# Altium schematic sheet FPGA_FLASH_EEPROM.SchDoc
size 420 x 297 mm; SheetNumber: 30; SheetTotal: 34
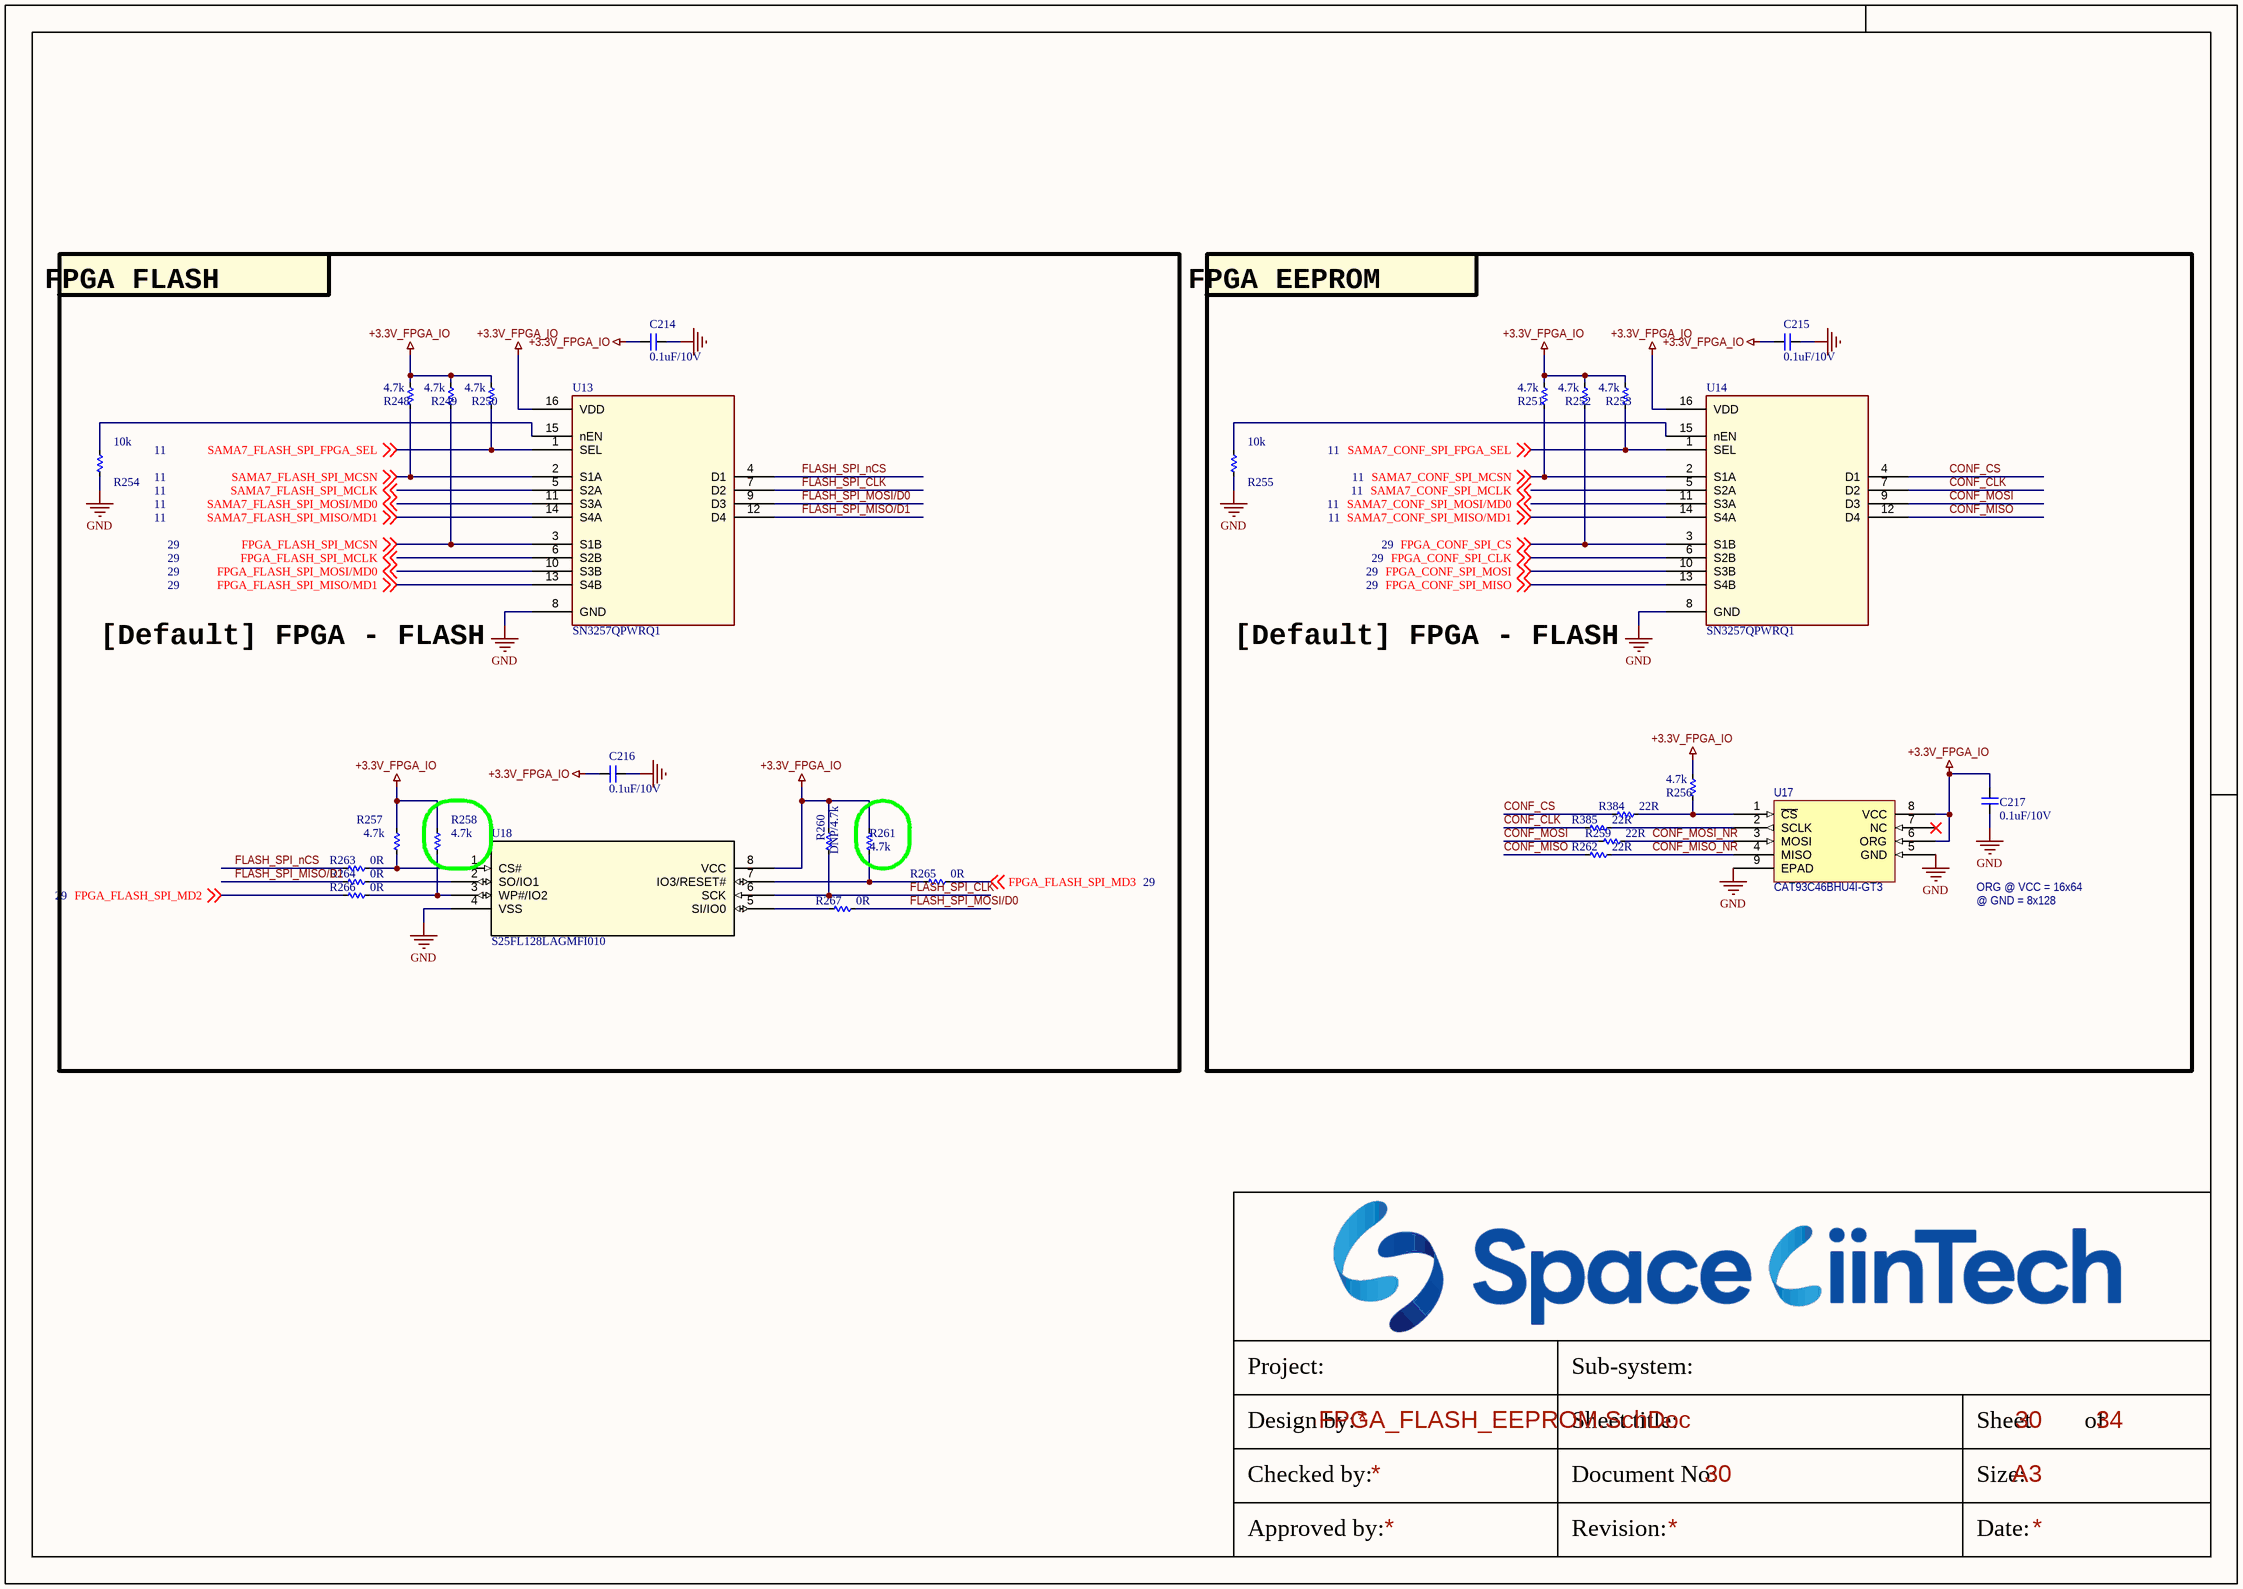
[diagram p0: FPGA_FLASH_EEPROM.SchDoc]

## Parts
C214  0.1uF/10V  [CAP_C_1005X50_L]
C215  0.1uF/10V  [CAP_C_1005X50_L]
C216  0.1uF/10V  [CAP_C_1005X50_L]
C217  0.1uF/10V  [CAP_C_1005X50_L]
R248  4.7k  [RES_C_1005x30_L]
R249  4.7k  [RES_C_1005x30_L]
R250  4.7k  [RES_C_1005x30_L]
R251  4.7k  [RES_C_1005x30_L]
R252  4.7k  [RES_C_1005x30_L]
R253  4.7k  [RES_C_1005x30_L]
R254  10k  [RES_C_1005x30_L]
R255  10k  [RES_C_1005x30_L]
R256  4.7k  [RES_C_1005x30_L]
R257  4.7k  [RES_C_1005x30_L]
R258  4.7k  [RES_C_1005x30_L]
R259  22R  [RES_C_1005x30_L]
R260  DNP/4.7k  [RES_C_1005x30_L]
R261  4.7k  [RES_C_1005x30_L]
R262  22R  [RES_C_1005x30_L]
R263  0R  [RES_C_1005x30_L]
R264  0R  [RES_C_1005x30_L]
R265  0R  [RES_C_1005x30_L]
R266  0R  [RES_C_1005x30_L]
R267  0R  [RES_C_1005x30_L]
R384  22R  [RES_C_1005x30_L]
R385  22R  [RES_C_1005x30_L]
U13  SN3257QPWRQ1  [SOIC_PRQ1_TEX]
U14  SN3257QPWRQ1  [SOIC_PRQ1_TEX]
U17  CAT93C46BHU4I-GT3  [CAT93C46BHU4I-GT3]
U18  S25FL128LAGMFI010  [SOIC8_S25FL_CYP]

## Nets
+3.3V_FPGA_IO: C214.2 C215.2 C216.2 C217.1 R248.2 R249.2 R250.2 R251.2 R252.2 R253.2 R256.2 R257.2 R258.2 R260.2 R261.2 U13.16(VDD) U14.16(VDD) U17.6(ORG) U17.8(VCC) U18.8(VCC)
GND: C214.1 C215.1 C216.1 C217.2 R254.1 R255.1 U13.8(GND) U14.8(GND) U17.5(GND) U17.9(EPAD) U18.4(VSS)
CONF_CLK: R385.2 U14.7(D2)
CONF_CS: R384.2 U14.4(D1)
CONF_MISO: R262.2 U14.12(D4)
CONF_MISO_NR: R262.1 U17.4(MISO)
CONF_MOSI: R259.2 U14.9(D3)
CONF_MOSI_NR: R259.1 U17.3(MOSI)
FLASH_SPI_CLK: R260.1 U13.7(D2) U18.6(SCK)
FLASH_SPI_MISO/D1: R264.1 U13.12(D4)
FLASH_SPI_MOSI/D0: R267.2 U13.9(D3)
FLASH_SPI_nCS: R263.1 U13.4(D1)
FPGA_CONF_SPI_CLK: U14.6(S2B) ; off-sheet FPGA_CONF_SPI_CLK
FPGA_CONF_SPI_CS: R252.1 U14.3(S1B) ; off-sheet FPGA_CONF_SPI_CS
FPGA_CONF_SPI_MISO: U14.13(S4B) ; off-sheet FPGA_CONF_SPI_MISO
FPGA_CONF_SPI_MOSI: U14.10(S3B) ; off-sheet FPGA_CONF_SPI_MOSI
FPGA_FLASH_SPI_MCLK: U13.6(S2B) ; off-sheet FPGA_FLASH_SPI_MCLK
FPGA_FLASH_SPI_MCSN: R249.1 U13.3(S1B) ; off-sheet FPGA_FLASH_SPI_MCSN
FPGA_FLASH_SPI_MD2: R266.1 ; off-sheet FPGA_FLASH_SPI_MD2
FPGA_FLASH_SPI_MD3: R265.2 ; off-sheet FPGA_FLASH_SPI_MD3
FPGA_FLASH_SPI_MISO/MD1: U13.13(S4B) ; off-sheet FPGA_FLASH_SPI_MISO/MD1
FPGA_FLASH_SPI_MOSI/MD0: U13.10(S3B) ; off-sheet FPGA_FLASH_SPI_MOSI/MD0
SAMA7_CONF_SPI_FPGA_SEL: R253.1 U14.1(SEL) ; off-sheet SAMA7_CONF_SPI_FPGA_SEL
SAMA7_CONF_SPI_MCLK: U14.5(S2A) ; off-sheet SAMA7_CONF_SPI_MCLK
SAMA7_CONF_SPI_MCSN: R251.1 U14.2(S1A) ; off-sheet SAMA7_CONF_SPI_MCSN
SAMA7_CONF_SPI_MISO/MD1: U14.14(S4A) ; off-sheet SAMA7_CONF_SPI_MISO/MD1
SAMA7_CONF_SPI_MOSI/MD0: U14.11(S3A) ; off-sheet SAMA7_CONF_SPI_MOSI/MD0
SAMA7_FLASH_SPI_FPGA_SEL: R250.1 U13.1(SEL) ; off-sheet SAMA7_FLASH_SPI_FPGA_SEL
SAMA7_FLASH_SPI_MCLK: U13.5(S2A) ; off-sheet SAMA7_FLASH_SPI_MCLK
SAMA7_FLASH_SPI_MCSN: R248.1 U13.2(S1A) ; off-sheet SAMA7_FLASH_SPI_MCSN
SAMA7_FLASH_SPI_MISO/MD1: U13.14(S4A) ; off-sheet SAMA7_FLASH_SPI_MISO/MD1
SAMA7_FLASH_SPI_MOSI/MD0: U13.11(S3A) ; off-sheet SAMA7_FLASH_SPI_MOSI/MD0
NetR254_2: R254.2 U13.15(nEN)
NetR255_2: R255.2 U14.15(nEN)
NetR256_1: R256.1 R384.1 U17.1(~{CS})
NetR257_1: R257.1 R263.2 U18.1(CS#)
NetR258_1: R258.1 R266.2 U18.3(WP#/IO2)
NetR261_1: R261.1 R265.1 U18.7(IO3/RESET#)
NetR264_2: R264.2 U18.2(SO/IO1)
NetR267_1: R267.1 U18.5(SI/IO0)
NetR385_1: R385.1 U17.2(SCLK)

Not connected (* = marked no-connect by the designer): U17 7(NC)*

## Notes on the sheet
- FPGA FLASH
- FPGA EEPROM
- [Default] FPGA - FLASH
- ORG @ VCC = 16x64
- @ GND = 8x128
- Project:
- Sub-system:
- Design by:
- Sheet title:
- Sheet
- of
- Checked by:
- Approved by:
- Revision:
- Document No:
- Size:
- Date:
- A3

## Library data of the parts
C214-C217 = _CAP_C_2: CAP
R248-R267 R384 R385 = _RES_B_2: RES
U13 U14 = IC_SW_SPI_SN3257QPWRQ1: Automotive 5-V, 2:1 (SPDT), 4-channel switch with 1.8-V logic and powered-off protection 16-TSSOP -40 to 125; Manufacturer_Name: Texas Instruments; Copyright: Copyright (C) 2025 Ultra Librarian. All rights reserved.; Manufacturer_Part_Number: SN3257QPWRQ1; Datasheet: https://www.ti.com/lit/gpn/sn3257-q1; RefDes: RefDes; Type: Type
U17 = CAT93C46BHU4I-GT3: EEPROM Memory IC 1Kb (128 x 8, 64 x 16) SPI 4 MHz 8-UDFN-EP (2x3); ComponentLink1URL: http://www.onsemi.com/pub_link/Collateral/CAT93C46B-D.PDF?src-supplier=Avnet; ComponentLink1Description: http://www.onsemi.com/pub_link/Collateral/CAT93C46B-D.PDF?src-supplier=Avnet; ComponentLink2URL: http://www.onsemi.com/pub/Collateral/CAT93C46B-D.PDF?src-supplier=Digi-Key; ComponentLink2Description: http://www.onsemi.com/pub/Collateral/CAT93C46B-D.PDF?src-supplier=Digi-Key; Supplier 1: Arrow Electronics; Supplier Part Number 1: CAT93C46BHU4I-GT3
U18 = S25FL128LAGMFI010: Description; Manufacturer_Name: Cypress Semiconductor; Copyright: Copyright (C) 2025 Ultra Librarian. All rights reserved.; Manufacturer_Part_Number: S25FL128LAGMFI010; RefDes: RefDes; Type: Type